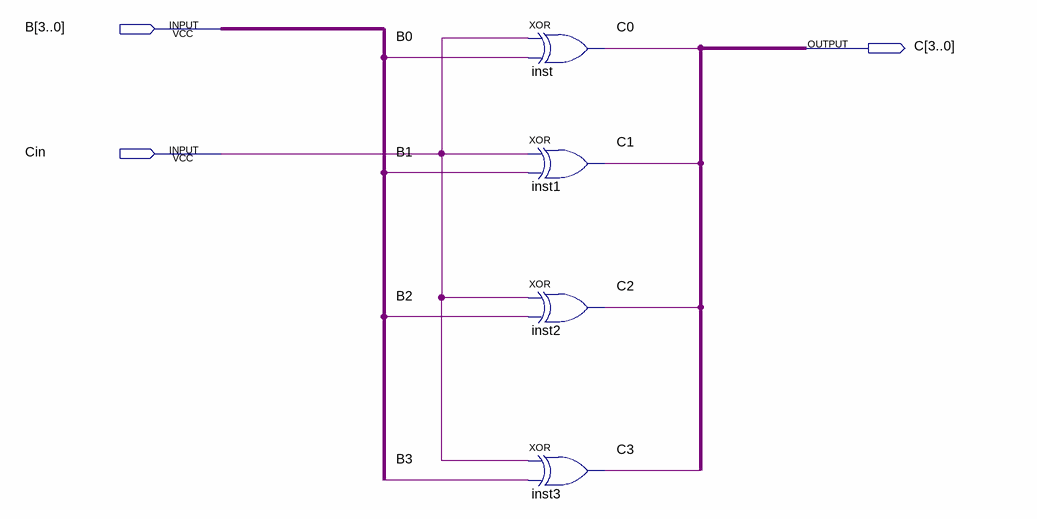
[diagram p0: schematic sheet]
// Quartus schematic inv_4bits.bdf as structural Verilog: 4 symbols, 3 pins
module inv_4bits (
  input  [3:0] B,
  input  Cin,
  output [3:0] C
);

  xor inst (C[0], Cin, B[0]);
  xor inst1 (C[1], Cin, B[1]);
  xor inst2 (C[2], Cin, B[2]);
  xor inst3 (C[3], Cin, B[3]);
endmodule
